# EAGLE design 8hp-board-phase (EAGLE 9.3.1)
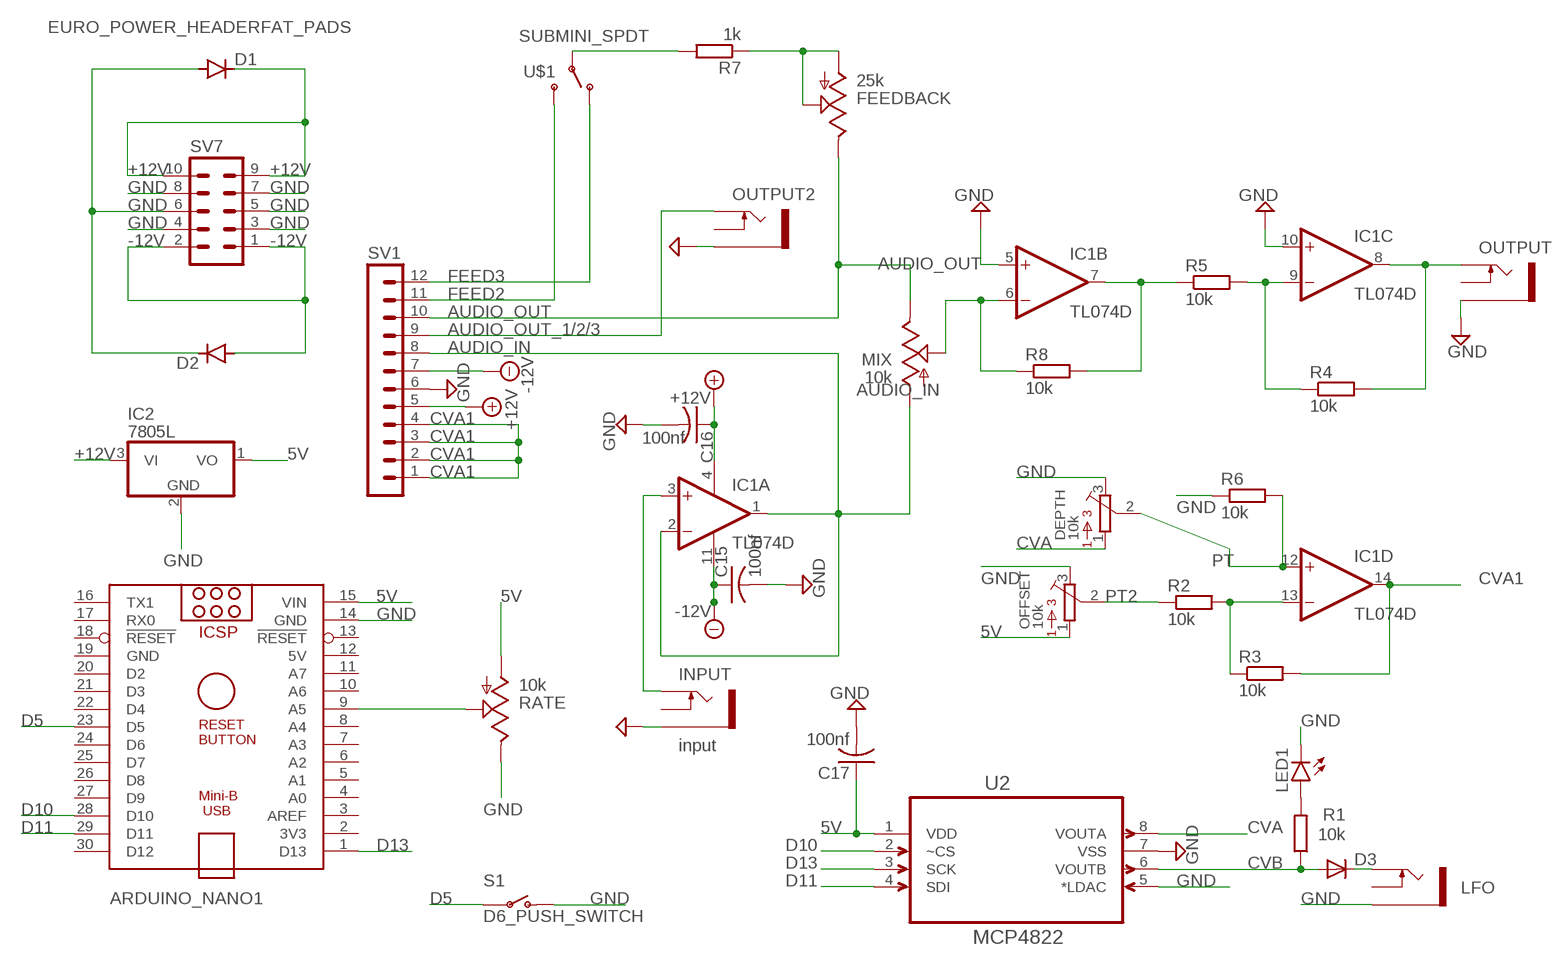
[diagram p0: schematic, sheet 1]

## Parts
ARDUINO_NANO1  ARDUINO_NANO  [ARDUINO_NANO]
C15  100nf  C-USC0805  [C0805]
C16  100nf  C-USC0805  [C0805]
C17  100nf  C-USC0805  [C0805]
D1  DIODE-SOD106A-R  [SOD106A-R]
D2  DIODE-SOD106A-R  [SOD106A-R]
D3  SMALL_DIODEDO35-7  [DO35-7]
DEPTH  10k  BOURNS_3362P_TRIMMERP  [BOURNS_3362P_TRIMMER]
FEEDBACK  25k  9MM_SNAP-IN_POT_  [9MM_SNAP-IN_POT]
IC1  TL074D  [SO14]
IC2  7805L  [TO92]
INPUT  input  THONKICONNNEW  [WQP-PJ301M-12_JACK]
LED1  LED3MM  [LED3MM]
LFO  output  THONKICONNNEW  [WQP-PJ301M-12_JACK]
MIX  10k  9MM_SNAP-IN_POT_  [9MM_SNAP-IN_POT]
OFFSET  10k  BOURNS_3362P_TRIMMERP  [BOURNS_3362P_TRIMMER]
OUTPUT  output  THONKICONNNEW  [WQP-PJ301M-12_JACK]
OUTPUT2  output  THONKICONNNEW  [WQP-PJ301M-12_JACK]
R1  10k  R-EU_M0805  [M0805]
R2  10k  R-EU_M0805  [M0805]
R3  10k  R-EU_M0805  [M0805]
R4  10k  R-EU_M0805  [M0805]
R5  10k  R-EU_M0805  [M0805]
R6  10k  R-EU_M0805  [M0805]
R7  1k  R-EU_M0805  [M0805]
R8  10k  R-EU_M0805  [M0805]
RATE  10k  9MM_SNAP-IN_POT_  [9MM_SNAP-IN_POT]
S1  D6_PUSH_SWITCH  [D6_PUSH_SWITCH]
SV1  MA12-1  [MA12-1]
SV7  EURO_POWER_HEADERFAT_PADS  [EURO_PWR_HEADER_FAT]
U2  MCP4822  MCP4802-E/SN  [SOIC127P600X175-8N]
U$1  SUBMINI_SPDT  [SUBMINI_TOGGLE]

## Nets
5V: ARDUINO_NANO1.15(VIN) C17.1 IC2.1(VO) OFFSET.1 RATE.1(A) U2.1(VDD)
+12V: C16.1 D1.C IC1.4(P:V+) IC2.3(VI) SV1.5 SV7.9 SV7.10
-12V: C15.1 D2.A IC1.11(P:V-) SV1.7 SV7.1 SV7.2
AUDIO_IN: IC1.1(A:OUT) IC1.2(A:-IN) MIX.1(A) SV1.8
AUDIO_OUT: FEEDBACK.3(E) MIX.3(E) SV1.10
AUDIO_OUT_1/2/3: OUTPUT2.P$1_TIP(TIP) SV1.9
CVA: DEPTH.1 U2.8(VOUTA)
CVA1: IC1.14(D:OUT) R3.2 SV1.1 SV1.2 SV1.3 SV1.4
CVB: D3.A R1.1 U2.6(VOUTB)
D5: ARDUINO_NANO1.23(D5) S1.P$3(P) S1.P$4(P)
D10: ARDUINO_NANO1.28(D10) U2.2(~CS)
D11: ARDUINO_NANO1.29(D11) U2.4(SDI)
D13: ARDUINO_NANO1.1(D13) U2.3(SCK)
FEED2: SV1.11 U$1.3(S)
FEED3: SV1.12 U$1.1(O)
GND: ARDUINO_NANO1.14(GND) C15.2 C16.2 C17.2 D1.A D2.C DEPTH.3 IC1.5(B:+IN) IC1.10(C:+IN) IC2.2(GND) INPUT.P$3_SLEEVE(SLEEVE) LED1.K(C) LFO.P$3_SLEEVE(SLEEVE) OFFSET.3 OUTPUT2.P$3_SLEEVE(SLEEVE) OUTPUT.P$3_SLEEVE(SLEEVE) R6.1 RATE.3(E) S1.P$1(O) S1.P$2(O) SV1.6 SV7.3 SV7.4 SV7.5 SV7.6 SV7.7 SV7.8 U2.5(*LDAC) U2.7(VSS)
N$1: IC1.13(D:-IN) R2.2 R3.1
N$2: D3.C LFO.P$1_TIP(TIP)
N$3: LED1.A R1.2
N$4: ARDUINO_NANO1.9(A5) RATE.2(S)
N$21: IC1.3(A:+IN) INPUT.P$1_TIP(TIP)
N$22: R7.2 U$1.COM(COMMON)
N$71: FEEDBACK.1(A) FEEDBACK.2(S) R7.1
N$72: IC1.6(B:-IN) MIX.2(S) R8.1
N$73: IC1.7(B:OUT) R5.1 R8.2
N$75: IC1.9(C:-IN) R4.1 R5.2
N$76: IC1.8(C:OUT) OUTPUT.P$1_TIP(TIP) R4.2
PT: DEPTH.2 IC1.12(D:+IN) R6.2
PT2: OFFSET.2 R2.1
Unconnected: ARDUINO_NANO1.2(3V3) ARDUINO_NANO1.3(AREF) ARDUINO_NANO1.4(A0) ARDUINO_NANO1.5(A1) ARDUINO_NANO1.6(A2) ARDUINO_NANO1.7(A3) ARDUINO_NANO1.8(A4) ARDUINO_NANO1.10(A6) ARDUINO_NANO1.11(A7) ARDUINO_NANO1.13(!RESET) ARDUINO_NANO1.16(TX1) ARDUINO_NANO1.17(RX0) ARDUINO_NANO1.18(!RESET) ARDUINO_NANO1.20(D2) ARDUINO_NANO1.21(D3) ARDUINO_NANO1.22(D4) ARDUINO_NANO1.24(D6) ARDUINO_NANO1.25(D7) ARDUINO_NANO1.26(D8) ARDUINO_NANO1.27(D9) ARDUINO_NANO1.30(D12) INPUT.P$2_SWITCH(SWITCH) LFO.P$2_SWITCH(SWITCH) OUTPUT2.P$2_SWITCH(SWITCH) OUTPUT.P$2_SWITCH(SWITCH)

## Power pins joined to a net without a drawn wire
5V: ARDUINO_NANO1.12(5V)
GND: ARDUINO_NANO1.19(GND)

## Library data of the parts
ARDUINO_NANO1 = ArduinoNanoV30:ARDUINO_NANO: Arduino Nano V3.0 Overview: The Arduino Nano is a small, complete, and breadboard-friendly board based on the ATmega328 (Arduino Nano 3.x) or ATmega168 (Arduino Nano 2.x). It has more or less the same functionality of the Arduino Duemilanove, but in a different package. It lacks only a DC power jack, and works with a Mini-B USB cable instead of a standard one. The Nano was designed and is being produced by Gravitech. Specifications: Microcontroller Atmel ATmega168 or ATmega328 Operating Voltage (logic level) 5 V Input Voltage (recommended) 7-12 V Input Voltage (limits) 6-20 V Digital I/O Pins 14 (of which 6 provide PWM output) Analog Input Pins 8 DC Current per I/O Pin 40 mA Flash Memory 16 KB (ATmega168) or 32 KB (ATmega328) of which 2 KB used by bootloader SRAM 1 KB (ATmega168) or 2 KB (ATmega328) EEPROM 512 bytes (ATmega168) or 1 KB (ATmega328) Clock Speed 16 MHz Dimensions 0.73" x 1.70" Length 45 mm Width 18 mm Weigth 5 g Power: The Arduino Nano can be powered via the Mini-B USB connection, 6-20V unregulated external power supply (pin 30), or 5V regulated external power supply (pin 27). The power source is automatically selected to the highest voltage source. Memory: The ATmega168 has 16 KB of flash memory for storing code (of which 2 KB is used for the bootloader); the ATmega328 has 32 KB, (also with 2 KB used for the bootloader). The ATmega168 has 1 KB of SRAM and 512 bytes of EEPROM (which can be read and written with the EEPROM library); the ATmega328 has 2 KB of SRAM and 1 KB of EEPROM. Input and Output: Each of the 14 digital pins on the Nano can be used as an input or output, using pinMode(), digitalWrite(), and digitalRead() functions. They operate at 5 volts. Each pin can provide or receive a maximum of 40 mA and has an internal pull-up resistor (disconnected by default) of 20-50 kOhms. In addition, some pins have specialized functions. Visit Arduino - ArduinoBoardNano <https://www.arduino.cc/en/Main/ArduinoBoardNano>
C15-C17 = rcl:C-US: CAPACITOR, American symbol; SPICEPREFIX: C
D1 D2 = diode:DIODE-: DIODE
D3 = MusicThingModular:SMALL_DIODE: Small Signal Diode
DEPTH OFFSET = MusicThingModular:BOURNS_3362P_TRIMMER: 3362 Series 1/4" Square Trimmer
FEEDBACK MIX RATE = MusicThingModular:9MM_SNAP-IN_POT: 9mm vertical snap-in pot, Alpha / Panasonic style
IC1 = linear:TL074: OP AMP
IC2 = linear:78*: Positive VOLTAGE REGULATOR Source: http://cache.national.com/ds/LM/LM78L05.pdf http://www.fairchildsemi.com/ds/LM/LM7805.pdf
INPUT LFO OUTPUT OUTPUT2 = MusicThingModular:THONKICONN: 3.5mm socket for Eurorack modular synths
LED1 = led:LED: LED OSRAM: - CHIPLED LG R971, LG N971, LY N971, LG Q971, LY Q971, LO R971, LY R971 LH N974, LH R974 LS Q976, LO Q976, LY Q976 LO Q996 - Hyper CHIPLED LW Q18S LB Q993, LB Q99A, LB R99A - SideLED LS A670, LO A670, LY A670, LG A670, LP A670 LB A673, LV A673, LT A673, LW A673 LH A674 LY A675 LS A676, LA A676, LO A676, LY A676, LW A676 LS A679, LY A679, LG A679 - Hyper Micro SIDELED® LS Y876, LA Y876, LO Y876, LY Y876 LT Y87S - SmartLED LW L88C, LW L88S LB L89C, LB L89S, LG L890 LS L89K, LO L89K, LY L89K LS L896, LA L896, LO L896, LY L896 - TOPLED LS T670, LO T670, LY T670, LG T670, LP T670 LSG T670, LSP T670, LSY T670, LOP T670, LYG T670 LG T671, LOG T671, LSG T671 LB T673, LV T673, LT T673, LW T673 LH T674 LS T676, LA T676, LO T676, LY T676, LB T676, LH T676, LSB T676, LW T676 LB T67C, LV T67C, LT T67C, LS T67K, LO T67K, LY T67K, LW E67C LS E67B, LA E67B, LO E67B, LY E67B, LB E67C, LV E67C, LT E67C LW T67C LS T679, LY T679, LG T679 LS T770, LO T770, LY T770, LG T770, LP T770 LB T773, LV T773, LT T773, LW T773 LH T774 LS E675, LA E675, LY E675, LS T675 LS T776, LA T776, LO T776, LY T776, LB T776 LHGB T686 LT T68C, LB T68C - Hyper Mini TOPLED® LB M676 - Mini TOPLED Santana® LG M470 LS M47K, LO M47K, LY M47K Source: http://www.osram.convergy.de LUXEON: - LUMILED® LXK2-PW12-R00, LXK2-PW12-S00, LXK2-PW14-U00, LXK2-PW14-V00 LXK2-PM12-R00, LXK2-PM12-S00, LXK2-PM14-U00 LXK2-PE12-Q00, LXK2-PE12-R00, LXK2-PE12-S00, LXK2-PE14-T00, LXK2-PE14-U00 LXK2-PB12-K00, LXK2-PB12-L00, LXK2-PB12-M00, LXK2-PB14-N00, LXK2-PB14-P00, LXK2-PB14-Q00 LXK2-PR12-L00, LXK2-PR12-M00, LXK2-PR14-Q00, LXK2-PR14-R00 LXK2-PD12-Q00, LXK2-PD12-R00, LXK2-PD12-S00 LXK2-PH12-R00, LXK2-PH12-S00 LXK2-PL12-P00, LXK2-PL12-Q00, LXK2-PL12-R00 Source: www.luxeon.com KINGBRIGHT: KA-3528ASYC Source: www.kingbright.com
R1-R8 = rcl:R-EU_: RESISTOR, European symbol; SPICEPREFIX: R
S1 = MusicThingModular:D6_PUSH_SWITCH: Push switch
SV1 = con-lstb:MA12-1: PIN HEADER; OC_FARNELL: unknown; OC_NEWARK: unknown
SV7 = MusicThingModular:EURO_POWER_HEADER: Power Header 10 pin power header for Eurorack Power Supplies Variants with fatter pads for easier soldering, and the LOCK variant which has 5mil offset pins to hold the component in place before soldering
U2 = MCP4802-E_SN:MCP4802-E/SN: DAC 8BIT DUAL SPI/VREF; DESCRIPTION: MCP4801 Series 2 Ch 8-bit SPI Interface Digital-to-Analog Converter - SOIC-8; DIGI-KEY_PART_NUMBER: MCP4802-E/SN-ND; DIGI-KEY_PURCHASE_URL: https://www.digikey.com/product-detail/en/microchip-technology/MCP4802-E-SN/MCP4802-E-SN-ND/2332808?utm_source=snapeda&utm_medium=aggregator&utm_campaign=symbol; MF: Microchip; MP: MCP4802-E/SN; PACKAGE: SOIC-8 Microchip
U$1 = MusicThingModular:SUBMINI_SPDT

## Net classes
0 default: width 0.635 mm, drill 0.254 mm, clearance 0.254 mm
1 thicker: width 1.905 mm, drill 0.254 mm, clearance 0.635 mm

## Board
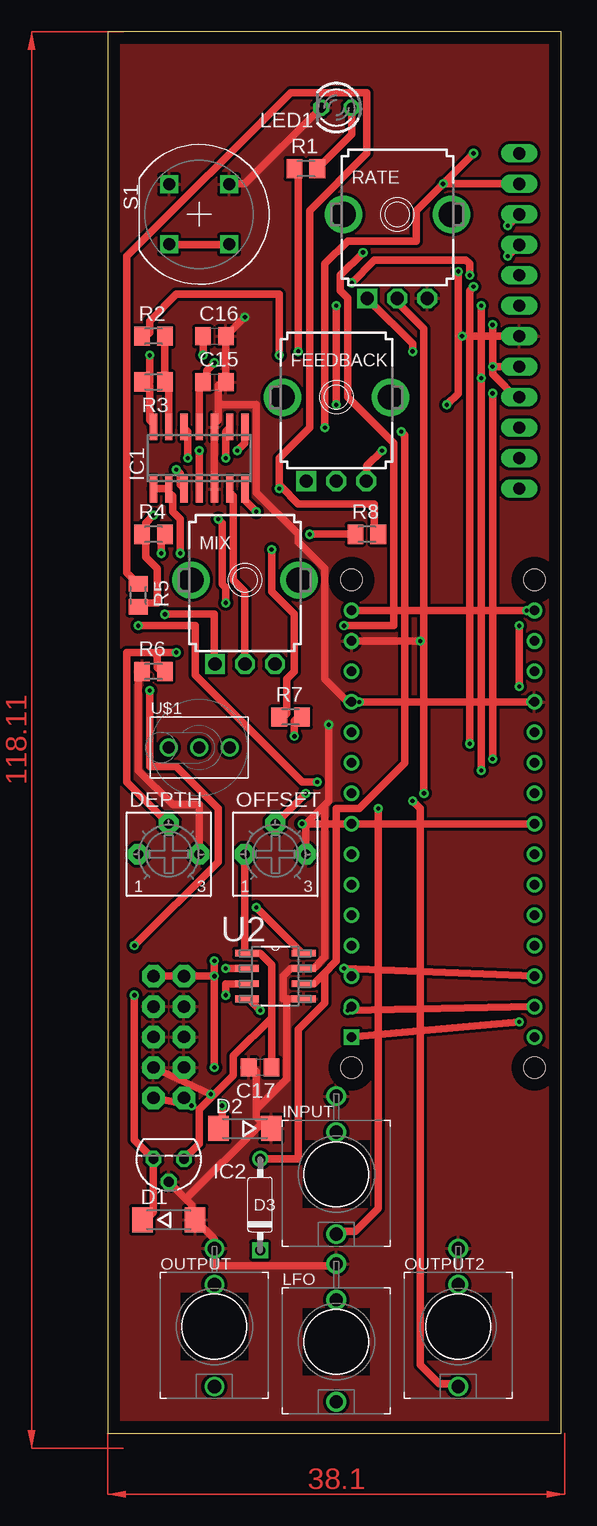
[diagram p1: board, top side]
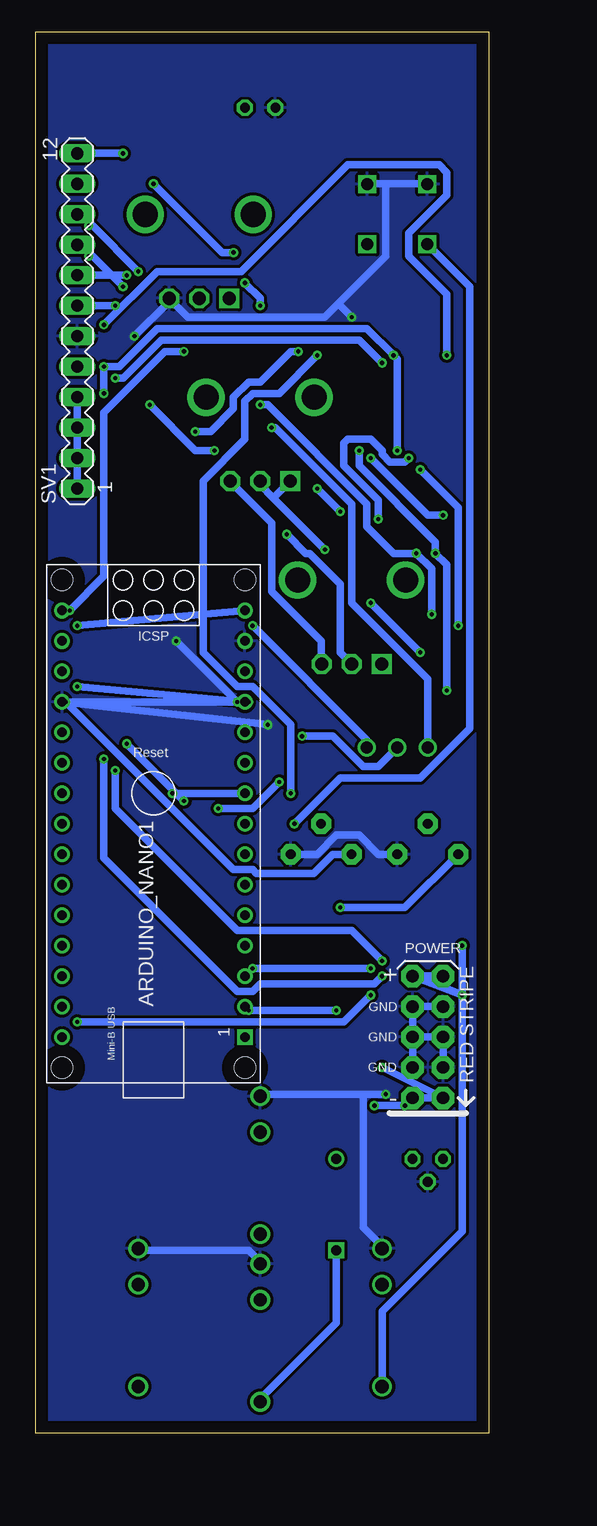
[diagram p2: board, bottom side, seen from below]

Size 37.77 x 116.83 mm. Coordinates in mm from the lower left corner, seen from the top.
Outline: 0,0 37.77,0 37.77,116.83 0,116.83 0,0
Copper layers (1*16): Top 0.035mm / dielectric 1.5mm / Bottom 0.035mm
Design rules "default": minimum track width 6mil, minimum drill 0.35mm, track to track 6mil, track to pad 6mil, pad to pad 6mil, via to via 6mil, smd to smd 6mil, copper to edge 40mil, drill to drill 6mil, minimum pad ring 10mil, minimum via ring 8mil, stop-mask expansion 4mil, vias tented up to drill 0mil, thermal gap 10mil

### Footprints (pad centres in the part's own frame; a part is rotated, then mirrored left to right if it is on the bottom)
ARDUINO_NANO = drill 0.8 square: 1 -20.32,-7.62 | drill 0.8: 2 -17.78,-7.62; 3 -15.24,-7.62; 4 -12.7,-7.62; 5 -10.16,-7.62; 6 -7.62,-7.62; 7 -5.08,-7.62; 8 -2.54,-7.62; 9 0,-7.62; 10 2.54,-7.62; 11 5.08,-7.62; 12 7.62,-7.62; 13 10.16,-7.62; 14 12.7,-7.62; 15 15.24,-7.62; 16 15.24,7.62; 17 12.7,7.62; 18 10.16,7.62; 19 7.62,7.62; 20 5.08,7.62; 21 2.54,7.62; 22 0,7.62; 23 -2.54,7.62; 24 -5.08,7.62; 25 -7.62,7.62; 26 -10.16,7.62; 27 -12.7,7.62; 28 -15.24,7.62; 29 -17.78,7.62; 30 -20.32,7.62 | hole 1.778: -22.86,-7.62; -22.86,7.62; 17.78,7.62; 17.78,-7.62
C0805 = smd 1.3 x 1.5: 1 -0.95,0; 2 0.95,0
SOD106A-R = smd 1.7 x 2.1: A 2.2,0; C -2.2,0
DO35-7 = drill 0.813: A 3.81,0 | drill 0.813 square: C -3.81,0
BOURNS_3362P_TRIMMER = drill 0.813 pad 1.676 octagon: 1 -2.54,0; 2 0,2.54; 3 2.54,0
9MM_SNAP-IN_POT = drill 1.1 square: 1 -2.5,-7 | drill 1.1 octagon: 2 0,-7; 3 2.5,-7 | drill 2.1 pad 2.794: CHASSIS1 -4.5,0; CHASSIS2 4.5,0
SO14 = smd 0.6 x 2.2: 1 -3.81,-2.6; 2 -2.54,-2.6; 3 -1.27,-2.6; 4 0,-2.6; 5 1.27,-2.6; 6 2.54,-2.6; 7 3.81,-2.6; 8 3.81,2.6; 9 2.54,2.6; 10 1.27,2.6; 11 0,2.6; 12 -1.27,2.6; 13 -2.54,2.6; 14 -3.81,2.6
TO92 = drill 0.813 octagon: 1 -1.27,0; 2 0,1.905; 3 1.27,0
WQP-PJ301M-12_JACK = drill 1.1: P$1_TIP 0,5; P$2_SWITCH 0,-3.5; P$3_SLEEVE 0,-6.5
LED3MM = drill 0.813 octagon: A -1.27,0; K 1.27,0
M0805 = smd 1.3 x 1.6: 1 -0.95,0; 2 0.95,0
D6_PUSH_SWITCH = drill 1 square: P$1 -2.5,2.5; P$2 2.5,2.5; P$3 2.5,-2.5; P$4 -2.5,-2.5
MA12-1 = drill 1.016 long: 1 -13.97,0; 2 -11.43,0; 3 -8.89,0; 4 -6.35,0; 5 -3.81,0; 6 -1.27,0; 7 1.27,0; 8 3.81,0; 9 6.35,0; 10 8.89,0; 11 11.43,0; 12 13.97,0
EURO_PWR_HEADER_FAT = drill 1.016 pad 1.88 octagon: 1 -5.08,-1.27; 2 -5.08,1.27; 3 -2.54,-1.27; 4 -2.54,1.27; 5 0,-1.27; 6 0,1.27; 7 2.54,-1.27; 8 2.54,1.27; 9 5.08,-1.27; 10 5.08,1.27
SOIC127P600X175-8N = smd 1.981 x 0.559: 1 -2.362,1.905; 2 -2.362,0.635; 3 -2.362,-0.635; 4 -2.362,-1.905; 5 2.362,-1.905; 6 2.362,-0.635; 7 2.362,0.635; 8 2.362,1.905
SUBMINI_TOGGLE = drill 1 pad 1.422: 1 -2.54,0; 3 2.54,0; COM 0,0

### Placement (x,y rotation side)
ARDUINO_NANO1  27.94,53.34 90 bottom
C15  8.89,87.63 0 top
C16  8.89,91.44 0 top
C17  12.7,30.48 180 top
D1  5.08,17.78 0 top
D2  11.43,25.4 180 top
D3  12.7,19.05 90 top
DEPTH  5.08,48.26 0 top
FEEDBACK  19.05,86.36 0 top
IC1  7.62,81.28 0 top
IC2  5.08,22.86 180 top
INPUT  19.05,21.59 180 top
LED1  19.05,110.49 180 top
LFO  19.05,7.62 180 top
MIX  11.43,71.12 0 top
OFFSET  13.97,48.26 0 top
OUTPUT  8.89,8.89 180 top
OUTPUT2  29.21,8.89 180 top
R1  16.51,105.41 0 top
R2  3.81,91.44 0 top
R3  3.81,87.63 180 top
R4  3.81,74.93 0 top
R5  2.54,69.85 270 top
R6  3.81,63.5 0 top
R7  15.24,59.69 0 top
R8  21.59,74.93 0 top
RATE  24.13,101.6 0 top
S1  7.62,101.6 0 top
SV1  34.29,92.71 90 bottom
SV7  5.08,33.02 90 bottom
U2  13.97,38.1 0 top
U$1  7.62,57.15 0 top

### Tracks (layer width: path | path; a pad name or v marks a point on that pad's centre or on a via)
5V  (via drill 0.35)
  Top 0.635: 13.65,34.61 13.65,39.05 12.7,40.01 U2.1 11.43,40.01 OFFSET.1 | 13.65,34.61 C17.1 | IC2.1 7.62,24.13 7.62,26.99 10.48,29.84 10.48,31.43 13.65,34.61 | v34.29,67.31 v34.29,62.23 | v25.4,90.17 25.4,90.81 21.91,94.3 RATE.1 | ARDUINO_NANO1.15 v34.92,68.58 | ARDUINO_NANO1.12 v35.24,60.96
  Bottom 0.635: v34.29,62.23 ARDUINO_NANO1.12 | ARDUINO_NANO1.15 v34.29,67.31 | v25.4,90.17 26.99,90.17 32.07,85.09 32.07,71.44 v34.92,68.58 | OFFSET.1 13.02,48.26 14.61,46.67 19.37,46.67 19.68,46.99 21.27,46.99 v35.24,60.96
+12V  (via drill 0.35)
  Top 0.635: D1.C 3.17,17.78 3.81,18.41 IC2.3 2.22,24.45 v2.22,36.51 | v7.94,89.85 C16.1 | SV1.5 v32.07,88.9 | v7.62,81.92 IC1.4 | v8.89,38.1 SV7.9 | v32.07,86.68 v32.07,56.2
  Bottom 0.635: SV7.9 SV7.10 v2.22,36.51 | v7.62,81.92 7.62,89.53 v7.94,89.85 10.16,92.08 27.62,92.08 30.8,88.9 v32.07,88.9 v32.07,86.68 | v8.89,38.1 9.53,37.47 19.05,37.47 19.68,36.83 20.95,36.83 32.07,47.94 v32.07,56.2
-12V  (via drill 0.35)
  Top 0.635: v9.53,27.3 9.53,25.4 D2.A | SV7.1 v6.99,27.3 | IC1.11 7.62,87.31 C15.1 8.26,87.63 8.26,88.58 v8.89,89.22 | v31.11,93.98 v31.11,87.95 v31.11,55.24 | v8.89,39.37 v8.89,30.48
  Bottom 0.635: v6.99,27.3 v9.53,27.3 | SV7.2 SV7.1 v8.89,30.48 | v31.11,93.98 SV1.7 | v31.11,87.95 30.48,87.95 27.3,91.12 10.79,91.12 v8.89,89.22 | v8.89,39.37 11.43,41.91 20.95,41.91 31.11,52.07 v31.11,55.24
AUDIO_IN  (via drill 0.35)
  Top 0.635: IC1.1 3.81,78.74 5.08,78.74 IC1.2 5.08,78.42 5.4,78.11 5.4,76.83 6.03,76.2 v6.03,73.34 | v4.76,68.26 8.89,68.26 8.89,64.14 MIX.1 | v30.16,96.52 30.16,97.47 29.84,97.79 22.23,97.79 v20.32,95.89 | v19.05,85.72 v19.05,93.98
  Bottom 0.635: v4.76,68.26 4.76,72.07 v6.03,73.34 7.94,73.34 10.16,75.56 10.16,77.47 18.41,85.72 v19.05,85.72 | v30.16,96.52 SV1.8 | v20.32,95.89 19.05,94.61 v19.05,93.98
AUDIO_OUT  (via drill 0.35)
  Top 0.635: v33.34,100.65 SV1.10 | v29.21,96.84 29.21,86.68 v28.26,85.72 | v22.86,81.92 21.59,80.64 21.59,79.38 FEEDBACK.3
  Bottom 0.635: v33.34,100.65 33.02,100.65 v29.21,96.84 | v28.26,85.72 24.45,81.92 v22.86,81.92 | MIX.3 13.97,64.14 13.97,66.04 18.1,70.17 18.1,75.88 21.27,79.06 FEEDBACK.3
AUDIO_OUT_1/2/3  (via drill 0.35)
  Top 0.635: v33.34,98.11 SV1.9 | v30.48,95.57 30.16,95.25 v30.16,57.47 | v25.4,52.7 26.04,52.07 26.04,5.71 27.62,4.13 29.21,4.13 OUTPUT2.P$1_TIP
  Bottom 0.635: v33.34,98.11 33.02,98.11 v30.48,95.57 | v25.4,52.7 v30.16,57.47
CVA  (via drill 0.35)
  Top 0.635: v12.38,43.81 16.19,40.01 U2.8
  Bottom 0.635: v12.38,43.81 6.99,43.81 DEPTH.1
CVA1  (via drill 0.35)
  Top 0.635: IC1.14 3.81,84.14 3.49,84.45 3.49,87.31 3.17,87.63 R3.2 3.49,87.63 v3.49,89.85 | v32.07,92.39 32.07,88.27 34.29,86.04
  Bottom 0.635: SV1.1 SV1.2 SV1.3 SV1.4 | v3.49,89.85 3.49,94.93 6.67,98.11 6.67,100.01 3.49,103.19 3.49,105.09 4.13,105.73 11.75,105.73 20.64,96.84 27.62,96.84 v32.07,92.39
CVB  (via drill 0.35)
  Top 0.635: v15.88,90.17 15.88,105.41 R1.1 | v24.45,83.5 24.77,83.19 24.77,55.88 20.95,52.07 19.05,52.07 19.05,39.37 17.94,38.26 | 17.94,38.26 17.14,37.47 U2.6 | D3.A 15.88,22.86 15.88,33.66 18.1,35.88 18.1,38.1 17.94,38.26
  Bottom 0.635: v15.88,90.17 16.51,90.17 19.05,87.63 20,87.63 21.27,86.36 21.27,85.41 23.18,83.5 v24.45,83.5
D5  (via drill 0.35)
  Top 0.635: v16.19,50.8 ARDUINO_NANO1.23 | S1.P$3 9.84,99.06 5.4,99.06 S1.P$4
  Bottom 0.635: v16.19,50.8 12.38,54.61 5.71,54.61 1.59,58.74 1.59,95.57 S1.P$4
D10  (via drill 0.35)
  Top 0.635: v9.84,38.73 U2.2 | ARDUINO_NANO1.28 v19.68,38.73
  Bottom 0.635: v19.68,38.73 v9.84,38.73
D11  (via drill 0.35)
  Top 0.635: v12.7,35.24 11.75,36.2 U2.4 | ARDUINO_NANO1.29 v20,35.24
  Bottom 0.635: v20,35.24 v12.7,35.24
D13  (via drill 0.35)
  Top 0.635: U2.3 9.84,37.47 v9.84,36.51 | ARDUINO_NANO1.1 v34.29,34.29
  Bottom 0.635: v9.84,36.51 12.06,34.29 v34.29,34.29
FEED2  (via drill 0.35)
  Top 0.635: v19.68,67.31 23.81,67.31 23.81,82.55 20,86.36 20,94.61 19.37,95.25 19.37,96.52 v21.27,98.42 | SV1.11 v27.94,104.14
  Bottom 0.635: U$1.3 10.16,57.78 v19.68,67.31 | v21.27,98.42 22.23,98.42 v27.94,104.14
FEED3  (via drill 0.35)
  Top 0.635: v18.1,83.82 18.1,97.47 20,99.38 25.72,99.38 25.72,101.92 v30.48,106.68
  Bottom 0.635: U$1.1 5.08,62.87 11.43,69.22 11.43,77.47 17.78,83.82 v18.1,83.82 | SV1.12 v30.48,106.68
GND  (via drill 0.35)
  Top 0.635: SV7.3 v8.57,28.26 | 14.92,36.2 14.61,36.2 14.61,38.1 15.24,38.73 U2.7 17.14,38.73 18.1,39.69 18.1,52.07 17.94,52.23 | 14.92,36.2 U2.5 | 12.38,26.99 12.38,26.35 12.86,25.88 | 12.38,26.99 12.38,30.16 12.06,30.48 C17.2 | 12.86,25.88 13.34,25.4 D2.C | 14.92,36.2 14.92,29.53 12.38,26.99 | 6.51,19.53 6.99,19.05 6.99,17.78 D1.A 7.3,17.78 8.89,16.19 OUTPUT.P$3_SLEEVE 8.89,13.97 19.05,13.97 LFO.P$3_SLEEVE | 6.51,19.53 IC2.2 | 6.51,19.53 12.86,25.88 | v29.53,91.44 SV1.6 | LED1.K 11.43,104.14 10.16,104.14 S1.P$2 | DEPTH.3 7.62,52.39 5.4,52.39 2.54,55.24 2.54,63.18 R6.1 | C16.2 C15.2 9.53,87.63 9.21,87.31 9.21,85.72 | IC1.5 IC1.10 8.89,84.14 9.21,84.45 9.21,85.72 | v18.41,59.05 18.41,52.7 17.94,52.23 | 17.94,52.23 16.51,50.8 OFFSET.3 | v26.04,66.04 ARDUINO_NANO1.14 | ARDUINO_NANO1.19 v20.95,60.96 | 9.21,85.72 12.38,85.72 12.38,78.42 15.88,74.93 15.88,74.3 18.1,72.07 18.1,62.87 v20,60.96 | C16.2 v11.43,93.03 | C16.2
  Bottom 0.635: SV7.7 SV7.8 SV7.6 | SV7.6 SV7.4 | SV7.6 SV7.5 SV7.3 | v8.57,28.26 10.48,28.26 | 10.48,28.26 19.05,28.26 INPUT.P$3_SLEEVE | OUTPUT2.P$3_SLEEVE 29.21,15.24 20,15.24 19.05,14.29 LFO.P$3_SLEEVE | 10.48,28.26 10.48,17.14 8.89,15.56 OUTPUT.P$3_SLEEVE | v29.53,91.44 26.67,94.3 RATE.3 26.35,94.3 25.08,93.03 13.65,93.03 12.54,94.14 | 8.57,104.14 9.84,104.14 S1.P$2 | 8.57,104.14 5.4,104.14 S1.P$1 | 12.54,94.14 8.57,98.11 8.57,104.14 | v18.41,59.05 ARDUINO_NANO1.19 v20.95,60.96 | v20.95,60.96 v26.04,66.04 | v20,60.96 v20.95,60.96 | DEPTH.3 9.21,48.26 10.79,49.85 12.7,49.85 14.29,48.26 OFFSET.3 | v11.43,93.03 12.54,94.14
  pour Top: 0,116.84 36.83,116.84 38.1,115.57 38.1,1.27 36.83,0 0,0
  pour Bottom: 0,116.84 36.83,116.84 38.1,115.57 38.1,1.27 36.83,0 0,0
N$1
  Top 0.635: R3.1 5.08,87.31 IC1.13 | R3.1 R2.2 | R3.1
N$2
  Bottom 0.635: D3.C 12.7,9.21 19.05,2.86 LFO.P$1_TIP
N$3
  Top 0.635: LED1.A 20.32,108.27 R1.2
N$4  (via drill 0.35)
  Top 0.635: v26.35,53.34 26.35,92.08 24.13,94.3 RATE.2
  Bottom 0.635: v26.35,53.34 ARDUINO_NANO1.9
N$21  (via drill 0.35)
  Top 0.635: v5.71,80.33 6.03,80.01 6.03,79.06 6.35,78.74 IC1.3 | v2.54,67.31 7.3,67.31 7.3,63.18 16.19,54.29 v17.46,54.29 | v22.54,52.07 22.54,18.73 20.64,16.83 19.05,16.83 INPUT.P$1_TIP
  Bottom 0.635: v5.71,80.33 2.54,77.15 v2.54,67.31 | v17.46,54.29 19.68,52.07 v22.54,52.07
N$22  (via drill 0.35)
  Top 0.635: v15.56,58.1 15.56,59.37 15.88,59.69 R7.2
  Bottom 0.635: v15.56,58.1 13.02,58.1 10.48,55.56 9.21,55.56 U$1.COM
N$71  (via drill 0.35)
  Top 0.635: v13.65,73.66 13.65,70.17 15.56,68.26 15.56,63.5 14.92,62.87 14.92,60.01 14.61,59.69 R7.1
  Bottom 0.635: 17.94,77.95 19.05,79.06 FEEDBACK.2 | 17.94,77.95 v13.65,73.66 | 17.94,77.95 16.83,79.06 FEEDBACK.1
N$72  (via drill 0.35)
  Top 0.635: v16.83,74.93 R8.1 | MIX.2 11.43,70.17 10.48,71.12 10.48,78.11 10.16,78.42 IC1.6
  Bottom 0.635: v16.83,74.93 15.24,73.34 14.92,73.34 12.38,70.8 12.38,65.09 11.43,64.14 MIX.2
N$73  (via drill 0.35)
  Top 0.635: 14.45,78.9 15.88,77.47 22.23,77.47 22.23,74.93 R8.2 | 14.45,78.9 14.29,79.06 14.29,81.28 16.83,83.82 16.83,101.92 21.59,106.68 21.59,111.76 15.24,111.76 1.59,98.11 1.59,71.75 R5.1 | IC1.7 11.43,77.79 v12.38,76.83 | v14.29,78.74 14.45,78.9
  Bottom 0.635: v14.29,78.74 v12.38,76.83
N$75  (via drill 0.35)
  Top 0.635: 3.17,74.93 3.17,73.03 4.13,72.07 4.13,69.22 2.54,69.22 R5.2 | v9.84,81.28 9.84,83.5 10.16,83.82 IC1.9 | v3.81,76.52 3.17,75.88 3.17,74.93 | 3.17,74.93 R4.1
  Bottom 0.635: v9.84,81.28 5.08,76.52 v3.81,76.52
N$76  (via drill 0.35)
  Top 0.635: v4.45,73.34 4.45,74.93 R4.2 | v10.79,81.92 11.43,82.55 IC1.8 | v2.22,40.64 9.21,47.62 9.21,52.07 5.71,55.56 3.49,55.56 v3.49,61.91
  Bottom 0.635: v10.79,81.92 10.79,80.64 4.45,74.3 v4.45,73.34 3.49,72.39 v3.49,61.91 | OUTPUT.P$1_TIP 8.89,10.16 2.22,16.83 v2.22,40.64
PT  (via drill 0.35)
  Top 0.635: 3.97,64.93 3.81,65.09 1.59,65.09 1.59,54.29 DEPTH.2 | 3.97,64.93 4.13,64.77 4.13,63.82 4.45,63.5 R6.2 | v6.67,81.28 6.67,83.5 6.35,83.82 IC1.12 | v9.21,76.2 9.53,75.88 9.53,70.8 9.84,70.48 v9.84,69.22 | v5.71,65.09 4.13,65.09 3.97,64.93
  Bottom 0.635: v6.67,81.28 6.99,80.96 8.26,80.96 8.89,81.6 8.89,81.92 9.84,82.87 11.75,82.87 12.06,82.55 12.06,80.64 9.21,77.79 v9.21,76.2 | v5.71,65.09 v9.84,69.22
PT2  (via drill 0.35)
  Top 0.635: v14.29,89.85 14.29,94.93 5.71,94.93 3.49,92.71 3.49,91.76 3.17,91.44 R2.1 | OFFSET.2 v16.51,53.34
  Bottom 0.635: v14.29,89.85 17.46,86.68 19.68,86.68 20.32,86.04 20.32,82.87 23.81,79.38 23.81,65.09 20.95,62.23 19.68,62.23 16.51,59.05 v16.51,53.34
(copper drawn outside any net)
  shapes: Top area x2